# Altium project Dual_Buck_PSU_12V_to_5V_3V3.PrjPcb
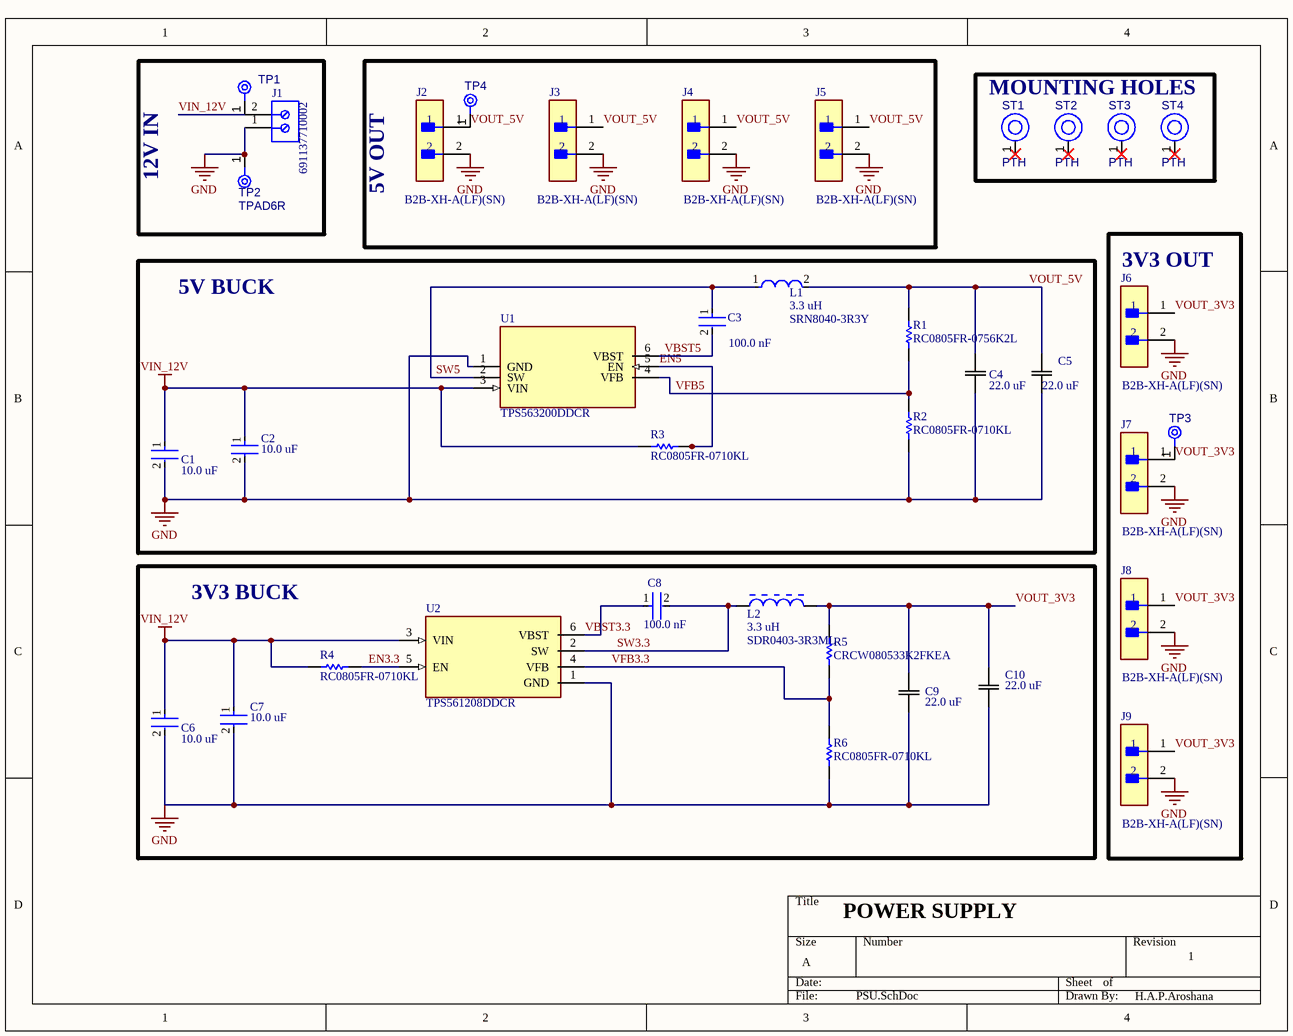
[diagram p0: PSU.SchDoc]
1 sheet, 37 parts. Net scope: global (net labels, ports and power ports of the same name join across sheets).
Board file: PSU.PcbDoc

## Sheet PSU.SchDoc
size A; SheetNumber: 1; SheetTotal: 1

### Parts
C1  Capacitance: 10.0 uF  [FP-GRM21B-0_2-e0_2_0_7-IPC_C]  (hidden comment: MSAST219LB5106KTNA01E44L)
C2  Capacitance: 10.0 uF  [FP-GRM21B-0_2-e0_2_0_7-IPC_C]  (hidden comment: MSAST219LB5106KTNA01E44L)
C3  Capacitance: 100.0 nF  [FP-GRM21B-0_2-e0_2_0_7-IPC_C]  (hidden comment: 08053C104KAT2A)
C4  value 22.0 uF  [CAPC2012X145N]  (hidden comment: GRM21BR61A226ME44L)
C5  value 22.0 uF  [CAPC2012X145N]  (hidden comment: GRM21BR61A226ME44L)
C6  Capacitance: 10.0 uF  [FP-GRM21B-0_2-e0_2_0_7-IPC_C]  (hidden comment: MSAST219LB5106KTNA01E44L)
C7  Capacitance: 10.0 uF  [FP-GRM21B-0_2-e0_2_0_7-IPC_C]  (hidden comment: MSAST219LB5106KTNA01E44L)
C8  Capacitance: 100.0 nF  [FP-GRM21B-0_2-e0_2_0_7-IPC_C]  (hidden comment: 08053C104KAT2A)
C9  value 22.0 uF  [CAPC2012X145N]  (hidden comment: GRM21BR61A226ME44L)
C10  value 22.0 uF  [CAPC2012X145N]  (hidden comment: GRM21BR61A226ME44L)
J1  691137710002  [691137710002]
J2  B2B-XH-A(LF)(SN)  [FP-B2B-XH-A_LF_SN-MFG]
J3  B2B-XH-A(LF)(SN)  [FP-B2B-XH-A_LF_SN-MFG]
J4  B2B-XH-A(LF)(SN)  [FP-B2B-XH-A_LF_SN-MFG]
J5  B2B-XH-A(LF)(SN)  [FP-B2B-XH-A_LF_SN-MFG]
J6  B2B-XH-A(LF)(SN)  [FP-B2B-XH-A_LF_SN-MFG]
J7  B2B-XH-A(LF)(SN)  [FP-B2B-XH-A_LF_SN-MFG]
J8  B2B-XH-A(LF)(SN)  [FP-B2B-XH-A_LF_SN-MFG]
J9  B2B-XH-A(LF)(SN)  [FP-B2B-XH-A_LF_SN-MFG]
L1  SRN8040-3R3Y  Inductance: 3.3 uH  [FP-SRN8040-MFG]
L2  SDR0403-3R3ML  Inductance (uH): 3.3 uH  [BOUR-SDR0403-2_V]
R1  RC0805FR-0756K2L  [RESC2013X60X35NL10T20]
R2  RC0805FR-0710KL  [RESC2013X60X35NL10T20]
R3  RC0805FR-0710KL  [RESC2013X60X35NL10T20]
R4  RC0805FR-0710KL  [RESC2013X60X35NL10T20]
R5  CRCW080533K2FKEA  [RESC2013X60X35NL10T20]
R6  RC0805FR-0710KL  [RESC2013X60X35NL10T20]
ST1  PTH  [Copy of PTH-M2D5X5]  (no BOM)
ST2  PTH  [Copy of PTH-M2D5X5]  (no BOM)
ST3  PTH  [Copy of PTH-M2D5X5]  (no BOM)
ST4  PTH  [Copy of PTH-M2D5X5]  (no BOM)
TP1  TPAD6R  [TP06R]  (value not drawn)  (no BOM)
TP2  TPAD6R  [TP06R]  (no BOM)
TP3  TPAD6R  [TP06R]  (value not drawn)  (no BOM)
TP4  TPAD6R  [TP06R]  (value not drawn)  (no BOM)
U1  TPS563200DDCR  [FP-DDC0006A-MFG]
U2  TPS561208DDCR  [FP-DDC0006A-MFG]

### Blocks framed on the sheet
12V IN: J1 TP1 TP2
5V OUT: J2-J5 TP4
MOUNTING HOLES: ST1-ST4
3V3 OUT: J6-J9 TP3
5V BUCK: C1-C5 L1 R1-R3 U1
3V3 BUCK: C6-C10 L2 R4-R6 U2

### Nets
GND: C1.2 C2.2 C4.1 C5.1 C6.2 C7.2 C9.1 C10.1 J1.1 J2.2 J3.2 J4.2 J5.2 J6.2 J7.2 J8.2 J9.2 R2.1 R6.1 TP2.1(TP) U1.1(GND) U2.1(GND)
VIN_12V: C1.1 C2.1 C6.1 C7.1 J1.2 R3.1 R4.1 TP1.1(TP) U1.3(VIN) U2.3(VIN)
EN3.3: R4.2 U2.5(EN)
EN5: R3.2 U1.5(EN)
SW3.3: C8.2 L2.1 U2.2(SW)
SW5: C3.1 L1.1 U1.2(SW)
VBST3.3: C8.1 U2.6(VBST)
VBST5: C3.2 U1.6(VBST)
VFB3.3: R5.1 R6.2 U2.4(VFB)
VFB5: R1.1 R2.2 U1.4(VFB)
VOUT_3V3: C9.2 C10.2 J6.1 J7.1 J8.1 J9.1 L2.2 R5.2 TP3.1(TP)
VOUT_5V: C4.2 C5.2 J2.1 J3.1 J4.1 J5.1 L1.2 R1.2 TP4.1(TP)

Not connected (* = marked no-connect by the designer): ST1 1(H1)*; ST2 1(H1)*; ST3 1(H1)*; ST4 1(H1)*

### Notes on the sheet
- POWER SUPPLY
- 1
- H.A.P.Aroshana

### Library data of the parts
C1 C2 C6 C7 = CMP-06035-039918-1: MSAST219LB5106KTNA01; Voltage Rating (DC): 10V; Dielectric Material: Ceramic; Tolerance: 20%; Dissipation Factor: 0.035%; Dielectric: X5R; Min Operating Temperature: -55°C; Height: 1.25mm; Depth: 1.25mm; Max Operating Temperature: 85°C; Width: 1.25mm; Lead Free: Lead Free; Weight: 0.000335oz; Voltage Rating: 10V; Case Code (Metric): 2012; Termination: SMD/SMT; Length: 2mm; Thickness: 0.057inch; Case/Package: 0805; Packaging: Tape and Reel; Voltage: 10V; Case Code (Imperial): 0805; Resistor Type: Ceramic; Package Quantity: 3000; Mount: Surface Mount
C3 C8 = CMP-06035-039918-1: Voltage Rating (DC): 10V; Dielectric Material: Ceramic; Tolerance: 20%; Dissipation Factor: 0.035%; Dielectric: X5R; Min Operating Temperature: -55°C; Height: 1.25mm; Depth: 1.25mm; Max Operating Temperature: 85°C; Width: 1.25mm; Lead Free: Lead Free; Weight: 0.000335oz; Voltage Rating: 10V; Case Code (Metric): 2012; Termination: SMD/SMT; Length: 2mm; Thickness: 0.057inch; Case/Package: 0805; Packaging: Tape and Reel; Voltage: 10V; Case Code (Imperial): 0805; Resistor Type: Ceramic; Package Quantity: 3000; Mount: Surface Mount
C4 C5 C9 C10 = GRM21BR61A226ME44L: SMD capacitor X5R(EIA) with capacitance 22uF Tol.20%. Rated voltage 10Vdc 85C; MF: Murata Electronics; SnapEDA_Link: https://www.snapeda.com/parts/GRM21BR61A226ME44L/Murata+Electronics+North+America/view-part/?ref=snap; Package: 2012 Murata; MP: GRM21BR61A226ME44L; Check_prices: https://www.snapeda.com/parts/GRM21BR61A226ME44L/Murata+Electronics+North+America/view-part/?ref=eda
J1 = CMP-1502-03324-3: Terminal Block, 5MM Pitch, Horizontal, Pressure Clamp Glow Wire, Pcb, 2PINS, Gr; Current Rating: 16A; Number of Contacts: 2; Voltage Rating: 300V; Number of Pins: 2; Min Operating Temperature: -30°C; Lead Pitch: 5mm; Packaging: Box; Max Operating Temperature: 120°C; RoHS: Compliant; Number of Rows: 1; Height: 11.6mm; Contact Material: Nickel, Tin
J2-J9 = CMP-2000-05888-3: CONN HEADER VERT 2POS 2.5MM; Current Rating: 3A; Voltage Rating: 250V; Number of Contacts: 2; Contact Resistance: 20mR; Wire/Cable Gauge: 22AWG; Insulation Resistance: 1GR; Connector Type: Male Pin; Packaging: Bulk; Contact Material: Brass; Lead Free: Lead Free; Orientation: Straight; Contact Plating: Tin; Max Current Rating: 3A; Termination: Solder; Fastening Type: Detent; Depth: 5.75mm; Housing Material: Polyamide; REACH SVHC: No SVHC; Series: XH; Voltage Rating (AC): 250V; Number of Positions: 2; Color: Natural; Contact Type: Male Pin; Max Voltage Rating (DC): 250V; Pitch: 2.5mm; Lead Pitch: 2.5mm; Mount: Through Hole; Max Operating Temperature: 85°C; Length: 7.4mm; Max Voltage Rating (AC): 250V; Min Operating Temperature: -25°C; Number of Rows: 1; Housing Color: White
L1 = CMP-07248-000074-1: FIXED IND 3.3UH 5.6A 21 MOHM SMD; Tolerance: 30%; Shielding: Shielded; DC Resistance (DCR): 21mR; Self Resonant Frequency: 34MHz; Material: Steel; Saturation Current: 5.5A; Sample Rate (Hz): 100kHz; Core Material: Ferrite; Depth: 8.3mm; Current Rating: 5.6A; DC Current: 5.6A; Max Operating Temperature: 125°C; REACH SVHC: No SVHC; Package Quantity: 1000; Resistor Type: Wirewound; RoHS Compliant: Yes; Width: 8mm; Case/Package: Nonstandard; Height: 4mm; Min Operating Temperature: -40°C; Number of Pins: 2; Series: SRN8040; RMS Current (Irms): 5.6A; Mount: Surface Mount; Military Standard: Not; Max DC Current: 5.6A; Termination: SMD/SMT; Packaging: Tape and Reel; Test Frequency: 100kHz; Height - Seated (Max): 0.157inch; Length: 8mm; Inductance Tolerance: 30%
L2 = CMP-0904-00015-1: SDR0403 Series Power Inductor, 3.3 uF +/- 20 %, 0.058 Ohm, -40 to 125 degC, 2-Pin SMD, RoHS, Tape and Reel; Manufacturer: Bourns; SRF (MHz): 65 Min.; Test Frequency (MHz): 7.96; Q: 28; Tolerance (%): +/- 20; RDC (Ohm): 0.058 Max.; I sat (A): 3 Typ.; I rms (A): 2.15 Max.; PackageDescription: 3-Pin SMD, Dia 4.5 mm, Height 3.5 mm; PartNumber: SDR0403-3R3ML; ComponentLink1Description: Manufacturer URL; Packing: Tape and Reel; ComponentLink1URL: http://www.bourns.com/; Temperature Range: -40 to 125 degC; DatasheetVersion: Feb-12; ComponentLink2URL: http://www.bourns.com/data/global/pdfs/sdr0403.pdf; Mounting Technology: Surface Mount; ComponentLink2Description: Datasheet; PackageReference: SDR0403-2; RoHS: TRUE
R1 = CMP-2001-01197-1: Manufacturer: Yageo; Value: 56.2 Kohm; Part Number: RC0805FR-0756K2L
R2-R4 R6 = CMP-1659-00013-4: Chip Resistor, 10 KOhm, +/- 1%, 0.125 W, -55 to 155 degC, 0805 (2012 Metric), RoHS, Tape and Reel; Manufacturer: Yageo; Voltage Rating: 150 V; Mount: Surface Mount; ComponentLink1Description: Manufacturer URL; ComponentLink2URL: http://www.yageo.com/documents/recent/PYu-RC_Group_51_RoHS_L_04.pdf; Pins: 2; Length: 2 mm; Min Operating Temperature: -55 degC; Height: 0.5 mm; Mounting Technology: Surface Mount; RoHSCompliant: true; REACH SVHC: No SVHC; ComponentLink1URL: http://www.yageo.com/; Max Operating Temperature: 155 degC; PackageReference: 0805; DatasheetVersion: Rev. 4, 02/2016; Package Quantity: 5000; Packaging: Tape and Reel; ComponentLink2Description: Datasheet; PackageDescription: 2-Pin Surface Mounted Device, Body 2 x 1.25 mm
R5 = CMP-1659-00013-4: RES Thick Film, 33.2kΩ, 1%, 0.125W, 100ppm/°C, 0805; Manufacturer: Yageo; Voltage Rating: 150 V; Mount: Surface Mount; ComponentLink1Description: Manufacturer URL; ComponentLink2URL: http://www.yageo.com/documents/recent/PYu-RC_Group_51_RoHS_L_04.pdf; Pins: 2; Length: 2 mm; Min Operating Temperature: -55 degC; Height: 0.5 mm; Mounting Technology: Surface Mount; RoHSCompliant: true; REACH SVHC: No SVHC; ComponentLink1URL: http://www.yageo.com/; Max Operating Temperature: 155 degC; PackageReference: 0805; DatasheetVersion: Rev. 4, 02/2016; Package Quantity: 5000; Packaging: Tape and Reel; ComponentLink2Description: Datasheet; PackageDescription: 2-Pin Surface Mounted Device, Body 2 x 1.25 mm
ST1-ST4 = CMP-00028-00010-1: 4mm, 3.2mm; Pins: 1
TP1-TP4 = CMP-00028-00002-3: 0.6mm round; Pins: 1
U1 = CMP-04918-000155-1: IC REG BUCK ADJ 3A TSOT23-6; Quiescent Current: 190uA; Output Voltage: 7V; Min Input Voltage: 4.5V; Output Configuration: Positive; Number of Outputs: 1; Switching Frequency: 650kHz; Synchronous Rectifier: Yes; Min Output Voltage: 760mV; Output Type: Adjustable; Operating Supply Voltage: 17V; Max Operating Temperature: 125°C; Lead Free: Lead Free; Packaging: Tape and Reel; Radiation Hardening: No; Mount: Surface Mount; Contact Plating: Tin; Output Current: 3A; Max Output Voltage: 7V; Min Operating Temperature: -40°C; Case/Package: SOT-23-6; Max Output Current: 3A; Max Input Voltage: 17V
U2 = CMP-04918-000155-1: 4.5V to 17V Input, 1A Output, Synchronous Step-Down Converter 6-SOT-23-THIN -40 to 125; Quiescent Current: 190uA; Output Voltage: 7V; Output Configuration: Positive; Number of Outputs: 1; Switching Frequency: 650kHz; Synchronous Rectifier: Yes; Output Current: 3A; Min Output Voltage: 760mV; Output Type: Adjustable; Max Operating Temperature: 125°C; Lead Free: Lead Free; Min Input Voltage: 4.5V; Packaging: Tape and Reel; Radiation Hardening: No; Mount: Surface Mount; Contact Plating: Tin; Max Output Voltage: 7V; Min Operating Temperature: -40°C; Case/Package: SOT-23-6; Max Output Current: 3A; Operating Supply Voltage: 17V; Max Input Voltage: 17V